# Altium schematic sheet TermoCouple.SchDoc
size A; SheetNumber: 5; SheetTotal: 5
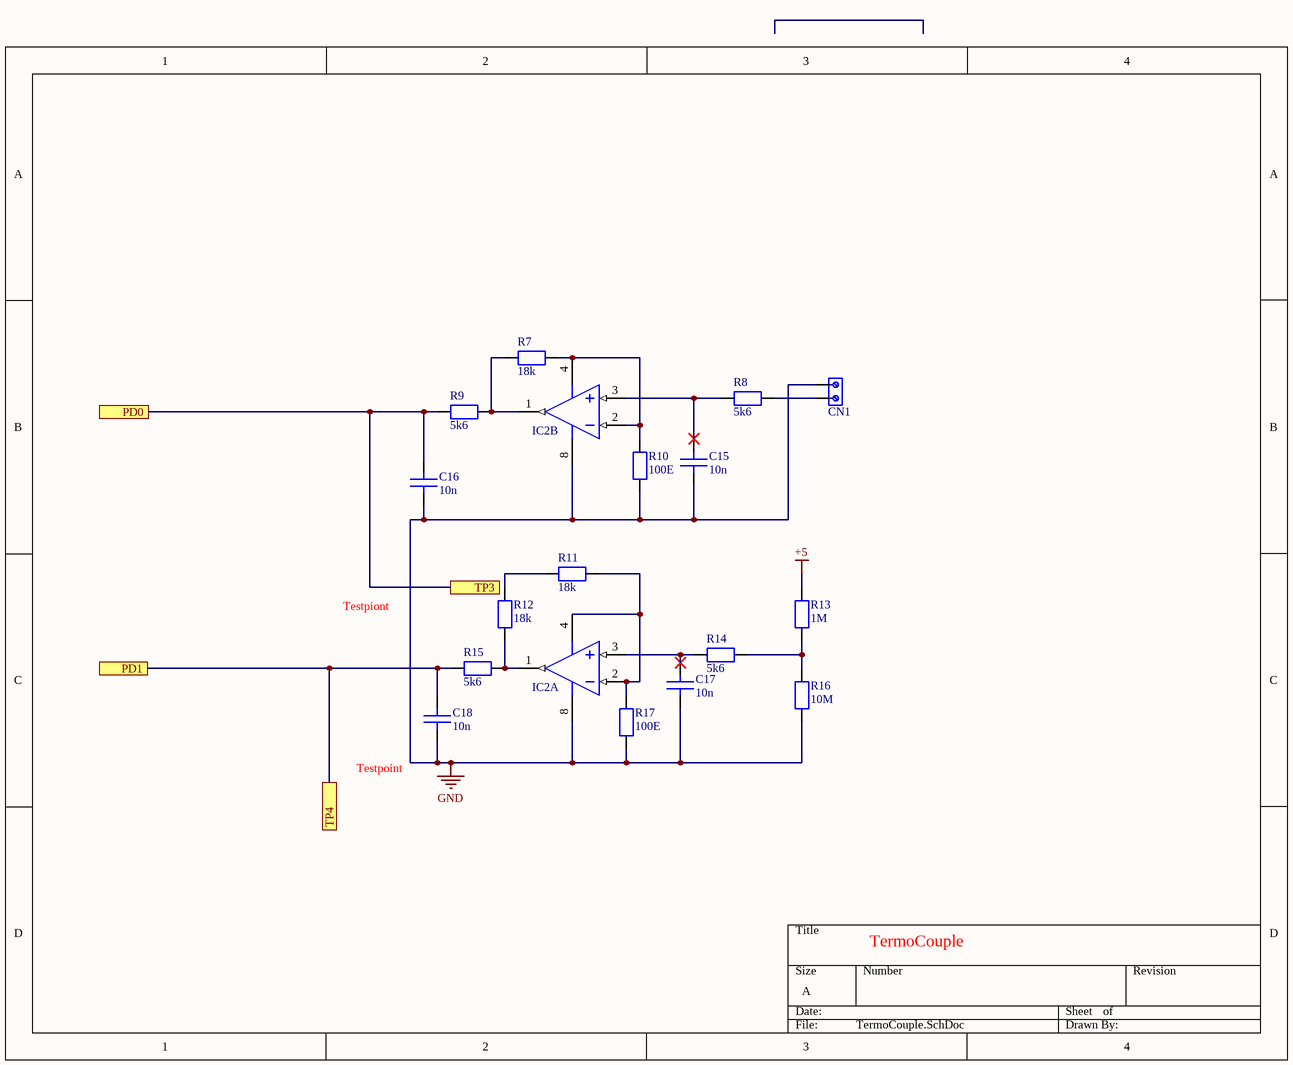
[diagram p0: TermoCouple.SchDoc]

## Parts
C15  10n  [CAP_0805]
C16  10n  [CAP_0805]
C17  10n  [CAP_0805]
C18  10n  [CAP_0805]
CN1  connecters 2pins  [conncecto 2 pins]  (value not drawn)
IC2A  MCP6002-E/P  [PDIP300-P8]  (value not drawn)
IC2B  MCP6002-E/P  [PDIP300-P8]  (value not drawn)
R7  18k  [RES_0805]
R8  5k6  [RES_0805]
R9  5k6  [RES_0805]
R10  100E  [RES_0805]
R11  18k  [RES_0805]
R12  18k  [RES_0805]
R13  1M  [RES_0805]
R14  5k6  [RES_0805]
R15  5k6  [RES_0805]
R16  10M  [RES_0805]
R17  100E  [RES_0805]

## Ports
PD0 (see CPU[1B]), PD1 (see CPU[1B]), TP3, TP4

## Nets
+5: R13.2
GND: C15.1 C16.2 C17.2 C18.1 CN1.1 IC2A.8(VDD) IC2B.8(VDD) R10.1 R16.1 R17.1
PD0: C16.1 R9.1 ; port PD0, port TP3
PD1: C18.2 R15.1 ; port PD1, port TP4
NetC15_2: C15.2 IC2B.3(VINA+) R8.1
NetC17_1: C17.1 IC2A.3(VINA+) R14.1
NetCN1_2: CN1.2 R8.2
NetIC2A_1: IC2A.1(VOUTA) R12.1 R15.2
NetIC2A_2: IC2A.2(VINA-) IC2A.4(VSS) R11.2 R17.2
NetIC2B_1: IC2B.1(VOUTA) R7.1 R9.2
NetIC2B_2: IC2B.2(VINA-) IC2B.4(VSS) R7.2 R10.2
NetR11_1: R11.1 R12.2
NetR13_1: R13.1 R14.2 R16.2

## Notes on the sheet
- Testpiont
- (near C18) Testpoint
- TermoCouple

## Library data of the parts
C15-C18 = CAP_0805: Capacitor SMD 0805 generic.; Manufacturer: *; Manufacture Part N: *; Tolerence: *; Voltage Rating: *; Dielectric: *
CN1 = pins: printkroonsteen 5,08 mm,
IC2A IC2B = MCP6002-E/P: Operational Amplifier, 2 Func, 4500uV Offset-Max, CMOS, PDIP8; Manufacturer: Microchip; Package Body Material: Plastic; Architecture: VOLTAGE-FEEDBACK; Common-mode Reject Ratio-Nom: 76dB; Frequency Compensation: YES; Input Offset Voltage-Max: 4.5mV; Low-Bias: No; Channels: 2; Package Equivalence Code: SOLCC8,.11,20; Power Supplies: 2.5V; Slew Rate: 0.6V/µs; Max Supply Current: 340uA; Supply Voltage Limit-Max: 7V; Nominal Supply Voltage: 5V; Surface Mount: No; Unity Gain BW-Nom: 1MHz; Voltage Gain-Min: 25110; Qualification Status: Not Qualified; Supplier: Avnet; Supplier Part Number: 88H9855; Manufacturer Part Number: MCP6002-E/P; RoHS: Yes; Category: Amplifiers - Op Amps, Buffer, Instrumentation; Stock: 25; Pricing: 1=0.377 (USD); Case/Package: DIP; Pins: 8; Package Shape: Rectangular; Terminal Finish: Tin; Min Operating Temperature: -40°C; Max Operating Temperature: 125°C; JESD-609 Code: e3; Amplifier Type: OPERATIONAL AMPLIFIER; JESD-30 Code: R-PDIP-T8; Low-Offset: No; Micropower: Yes; Package Style: IN-LINEMeter; Power: No; Programmable Power: No; Technology: CMOS; Terminal Form: Through Hole; Terminal Position: DUAL; Wideband: No; Length: 9.271mm; Width: 7.62mm; Height - Seated (Max): 5.33mm; Terminal Pitch: 2.54mm; Temperature Grade: AUTOMOTIVE; Reach SVHC Compliant: Yes; RoHS Compliant: Yes; ComponentLink1URL: https://datasheet.ciiva.com:443/pdfs/VipMasterIC/IC/MCHP/MCHP-S-A0010037088/MCHP-S-A0010037127-1.pdf?src-supplier=IHS+Markit; ComponentLink1Description: https://datasheet.ciiva.com:443/pdfs/VipMasterIC/IC/MCHP/MCHP-S-A0010037088/MCHP-S-A0010037127-1.pdf?src-supplier=IHS+Markit; ComponentLink2URL: https://datasheet.ciiva.com/19474/1285888-19474433.pdf?src-supplier=Jameco; ComponentLink2Description: https://datasheet.ciiva.com/19474/1285888-19474433.pdf?src-supplier=Jameco; ComponentLink3URL: https://datasheet.ciiva.com/26922/getdatasheetpartid-772743-26922641.pdf?src-supplier=Verical; ComponentLink3Description: https://datasheet.ciiva.com/26922/getdatasheetpartid-772743-26922641.pdf?src-supplier=Verical; ComponentLink4URL: https://datasheet.ciiva.com/16347/filehandler-aspxddocname-en011705-16347733.pdf?src-supplier=Future+Electronics; ComponentLink4Description: https://datasheet.ciiva.com/16347/filehandler-aspxddocname-en011705-16347733.pdf?src-supplier=Future+Electronics; ComponentLink5URL: https://datasheet.ciiva.com/7653/524878-7653495.pdf?src-supplier=Element14; ComponentLink5Description: https://datasheet.ciiva.com/7653/524878-7653495.pdf?src-supplier=Element14; ComponentLink6URL: https://datasheet.ciiva.com/14151/bsmicrochip-op-verstaerker-mcp600-en-14151451.pdf?src-supplier=Distrelec; ComponentLink6Description: https://datasheet.ciiva.com/14151/bsmicrochip-op-verstaerker-mcp600-en-14151451.pdf?src-supplier=Distrelec; ComponentLink7URL: https://datasheet.ciiva.com/11706/jp011705-11706855.pdf?src-supplier=Avnet; ComponentLink7Description: https://datasheet.ciiva.com/11706/jp011705-11706855.pdf?src-supplier=Avnet; ComponentLink8URL: https://datasheet.ciiva.com/1802/21733j-1802727.pdf?src-supplier=Digikey; ComponentLink8Description: https://datasheet.ciiva.com/1802/21733j-1802727.pdf?src-supplier=Digikey; ComponentLink9URL: https://datasheet.ciiva.com/4758/21733e-41017-4758151.pdf?src-supplier=Mouser; ComponentLink9Description: https://datasheet.ciiva.com/4758/21733e-41017-4758151.pdf?src-supplier=Mouser
R7-R17 = RES_0805: SMD size 0805 Generic.; Manufacturer: *; Manufacture Part N: *; Tolerence: *; Package Size: *; Voltage Rating: *